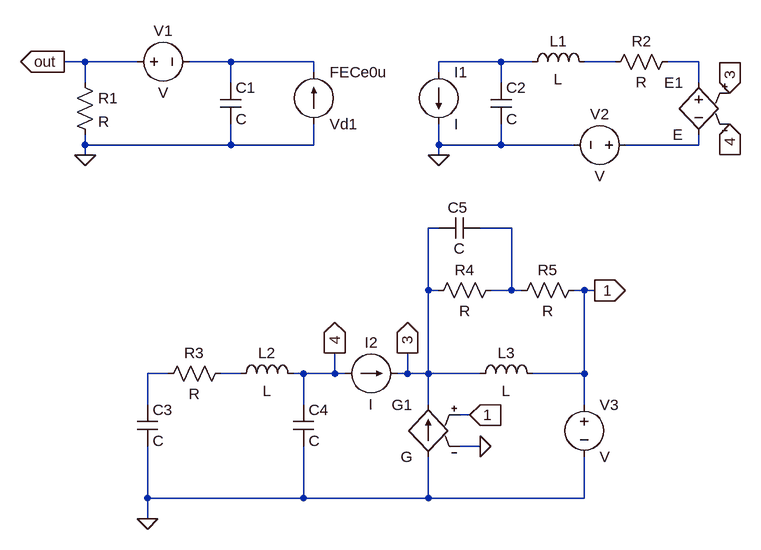
[diagram p0: schematic microphone schematic.asc]
microphone schematic.asc, the LTspice schematic file:
Version 4.1
SHEET 1 972 804
WIRE -96 80 -128 80
WIRE -16 80 -96 80
WIRE 128 80 64 80
WIRE 256 80 128 80
WIRE 544 80 448 80
WIRE 592 80 544 80
WIRE 720 80 672 80
WIRE 848 80 800 80
WIRE 256 96 256 80
WIRE 448 96 448 80
WIRE -96 112 -96 80
WIRE 128 112 128 80
WIRE 544 112 544 80
WIRE 848 112 848 80
WIRE -96 208 -96 192
WIRE 128 208 128 176
WIRE 128 208 -96 208
WIRE 256 208 256 176
WIRE 256 208 128 208
WIRE 448 208 448 176
WIRE 544 208 544 176
WIRE 544 208 448 208
WIRE 656 208 544 208
WIRE 848 208 848 192
WIRE 848 208 736 208
WIRE -96 224 -96 208
WIRE 448 224 448 208
WIRE 448 336 432 336
WIRE 560 336 512 336
WIRE 432 432 432 336
WIRE 448 432 432 432
WIRE 560 432 560 336
WIRE 560 432 528 432
WIRE 576 432 560 432
WIRE 672 432 656 432
WIRE 688 432 672 432
WIRE 32 560 0 560
WIRE 144 560 112 560
WIRE 240 560 224 560
WIRE 288 560 288 528
WIRE 288 560 240 560
WIRE 304 560 288 560
WIRE 400 560 400 528
WIRE 400 560 384 560
WIRE 432 560 432 432
WIRE 432 560 400 560
WIRE 512 560 432 560
WIRE 672 560 672 432
WIRE 672 560 592 560
WIRE 0 608 0 560
WIRE 240 608 240 560
WIRE 432 608 432 560
WIRE 672 608 672 560
WIRE 496 624 480 624
WIRE 512 672 480 672
WIRE 0 752 0 672
WIRE 240 752 240 672
WIRE 240 752 0 752
WIRE 432 752 432 688
WIRE 432 752 240 752
WIRE 672 752 672 688
WIRE 672 752 432 752
WIRE 0 784 0 752
FLAG -96 224 0
FLAG 448 224 0
FLAG 0 784 0
FLAG 512 672 0
FLAG 896 128 3
IOPIN 896 128 In
FLAG 400 528 3
IOPIN 400 528 Out
FLAG 288 528 4
IOPIN 288 528 Out
FLAG 896 176 4
IOPIN 896 176 In
FLAG 496 624 1
IOPIN 496 624 In
FLAG 688 432 1
IOPIN 688 432 Out
FLAG -128 80 out
IOPIN -128 80 Out
SYMBOL res -112 96 R0
SYMATTR InstName R1
SYMBOL voltage -32 80 R270
WINDOW 0 32 56 VTop 2
WINDOW 3 -32 56 VBottom 2
SYMATTR InstName V1
SYMBOL cap 112 112 R0
SYMATTR InstName C1
SYMBOL current 256 176 M180
WINDOW 0 24 80 Left 2
WINDOW 3 24 0 Left 2
SYMATTR InstName FECe0u
SYMATTR Value Vd1
SYMBOL current 448 96 R0
SYMATTR InstName I1
SYMBOL cap 528 112 R0
SYMATTR InstName C2
SYMBOL voltage 752 208 R90
WINDOW 0 -32 56 VBottom 2
WINDOW 3 32 56 VTop 2
SYMATTR InstName V2
SYMBOL e 848 96 M0
SYMATTR InstName E1
SYMBOL res 816 64 R90
WINDOW 0 0 56 VBottom 2
WINDOW 3 32 56 VTop 2
SYMATTR InstName R2
SYMBOL ind 576 96 R270
WINDOW 0 32 56 VTop 2
WINDOW 3 5 56 VBottom 2
SYMATTR InstName L1
SYMBOL cap -16 608 R0
SYMATTR InstName C3
SYMBOL cap 224 608 R0
SYMATTR InstName C4
SYMBOL res 128 544 R90
WINDOW 0 0 56 VBottom 2
WINDOW 3 32 56 VTop 2
SYMATTR InstName R3
SYMBOL ind 128 576 R270
WINDOW 0 32 56 VTop 2
WINDOW 3 5 56 VBottom 2
SYMATTR InstName L2
SYMBOL voltage 672 592 R0
SYMATTR InstName V3
SYMBOL ind 496 576 R270
WINDOW 0 32 56 VTop 2
WINDOW 3 5 56 VBottom 2
SYMATTR InstName L3
SYMBOL current 304 560 R270
WINDOW 0 32 40 VTop 2
WINDOW 3 -32 40 VBottom 2
SYMATTR InstName I2
SYMBOL res 544 416 R90
WINDOW 0 0 56 VBottom 2
WINDOW 3 32 56 VTop 2
SYMATTR InstName R4
SYMBOL res 672 416 R90
WINDOW 0 0 56 VBottom 2
WINDOW 3 32 56 VTop 2
SYMATTR InstName R5
SYMBOL cap 512 320 R90
WINDOW 0 0 35 VBottom 2
WINDOW 3 32 32 VTop 2
SYMATTR InstName C5
SYMBOL g 432 592 M0
SYMATTR InstName G1

The netlist it stands for:
* microphone schematic.asc
R1 out 0 R
V1 out N001 V
C1 N001 0 C
I§FECe0u 0 N001 Vd1
I1 N002 0 I
C2 N002 0 C
V2 N005 0 V
E1 N004 N005 3 4 E
R2 N004 N003 R
L1 N002 N003 L
C3 N007 0 C
C4 4 0 C
R3 N008 N007 R
L2 N008 4 L
V3 1 0 V
L3 3 1 L
I2 4 3 I
R4 N006 3 R
R5 1 N006 R
C5 N006 3 C
G1 0 3 1 0 G
.backanno
.end